# Altium project Pong.PrjPcb (part 2 of 2)

## Sheet VertBallControl.SchDoc: Vertical Ball Control
size A4
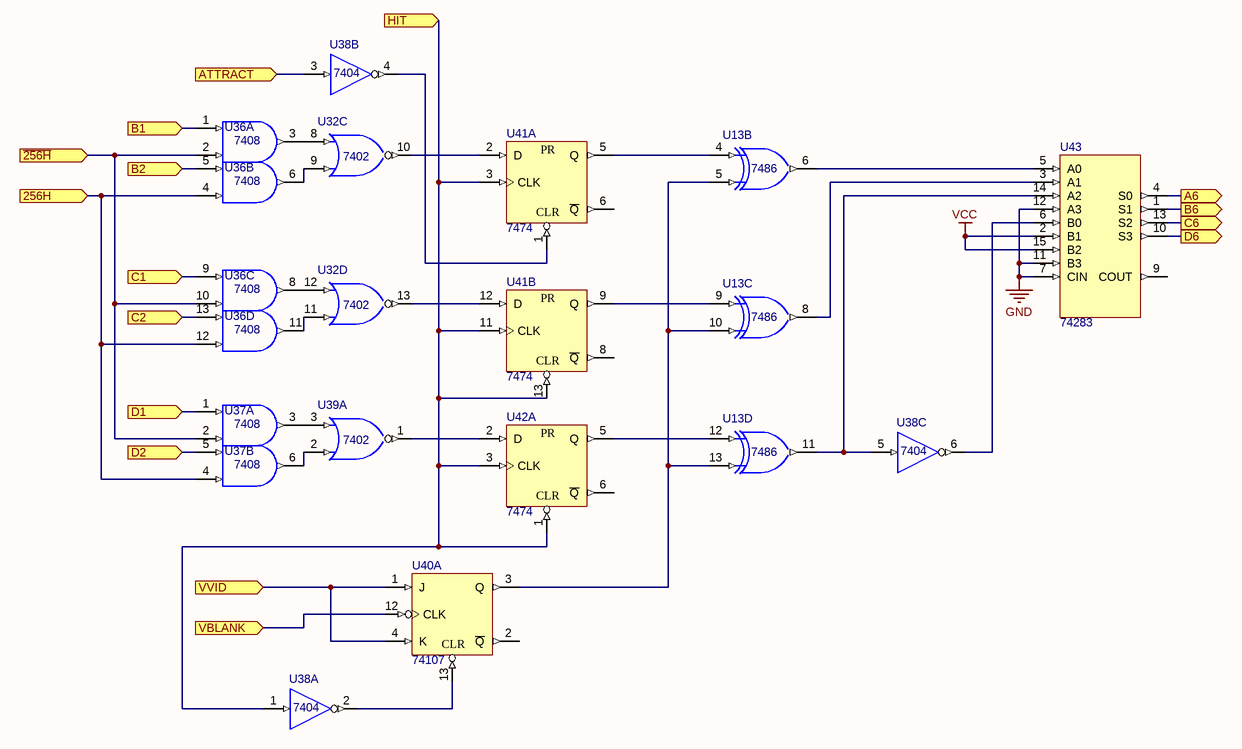
[diagram p11: VertBallControl.SchDoc]

### Parts
U13  7486  [N014]  (parts B,C,D of 4)
U32  7402  [N014]  (parts C,D of 4)
U36  7408  [N014]  (parts A,B,C,D of 4)
U37  7408  [N014]  (parts A,B of 4)
U38  7404  [N014]  (parts A,B,C of 6)
U39  7402  [N014]  (part A of 4)
U40  74107  [N014]  (part A of 2)
U41  7474  [N014D]  (parts A,B of 2)
U42  7474  [N014D]  (part A of 2)
U43  74283  [N016D]

### Ports
256H, A6, ATTRACT, B1, B2, B6, C1, C2, C6, D1, D2, D6, HIT, VBLANK, VVID, ~{256H}

### Nets
GND: U13.7(GND) U32.7(GND) U36.7(GND) U37.7(GND) U38.7(GND) U39.7(GND) U40.7(GND) U41.7(GND) U42.7(GND) U43.7(CIN) U43.8(GND) U43.11(B3) U43.12(A3)
VCC: U13.14(VCC) U32.14(VCC) U36.14(VCC) U37.14(VCC) U38.14(VCC) U39.14(VCC) U40.14(VCC) U41.4(PR) U41.10(PR) U41.14(VCC) U42.4(PR) U42.14(VCC) U43.2(B1) U43.15(B2) U43.16(VCC)
256H: U36.4(A) U36.12(A) U37.4(A) ; port 256H
~{256H}: U36.2(B) U36.10(B) U37.2(B) ; port ~{256H}
A6: U43.4(S0) ; port A6
ATTRACT: U38.3(A) ; port ATTRACT
B1: U36.1(A) ; port B1
B2: U36.5(B) ; port B2
B6: U43.1(S1) ; port B6
C1: U36.9(A) ; port C1
C2: U36.13(B) ; port C2
C6: U43.13(S2) ; port C6
D1: U37.1(A) ; port D1
D2: U37.5(B) ; port D2
D6: U43.10(S3) ; port D6
HIT: U38.1(A) U41.3(CLK) U41.11(CLK) U41.13(CLR) U42.1(CLR) U42.3(CLK) ; port HIT
VBLANK: U40.12(CLK) ; port VBLANK
VVID: U40.1(J) U40.4(K) ; port VVID
NetU13_4: U13.4(A) U41.5(Q)
NetU13_5: U13.5(B) U13.10(B) U13.13(B) U40.3(Q)
NetU13_6: U13.6(Y) U43.5(A0)
NetU13_8: U13.8(Y) U43.3(A1)
NetU13_9: U13.9(A) U41.9(Q)
NetU13_11: U13.11(Y) U38.5(A) U43.14(A2)
NetU13_12: U13.12(A) U42.5(Q)
NetU32_8: U32.8(A) U36.3(Y)
NetU32_9: U32.9(B) U36.6(Y)
NetU32_10: U32.10(Y) U41.2(D)
NetU32_11: U32.11(A) U36.11(Y)
NetU32_12: U32.12(B) U36.8(Y)
NetU32_13: U32.13(Y) U41.12(D)
NetU37_3: U37.3(Y) U39.3(B)
NetU37_6: U37.6(Y) U39.2(A)
NetU38_2: U38.2(Y) U40.13(CLR)
NetU38_4: U38.4(Y) U41.1(CLR)
NetU38_6: U38.6(Y) U43.6(B0)
NetU39_1: U39.1(Y) U42.2(D)

Not connected (* = marked no-connect by the designer): U40 2(~{Q}); U41 6(~{Q}) 8(~{Q}); U42 6(~{Q}); U43 9(COUT)

### Notes on the sheet
- Text
- Page
- PONG

### Library data of the parts
U13 = SN74LS86AN: Quadruple 2-Input Exclusive-OR Gate; Published: 8-Jun-2000; LatestRevisionDate: 04-Mar-2005; LatestRevisionNote: Stylized 3D Model Added.; DatasheetVersion: Mar-1988; PackageVersion: Oct-1995; PackageReference: N014; Publisher: Altium Limited; PackageDescription: DIP; 14 Leads; Row Spacing 7.62 mm; Pitch 2.54 mm; ComponentLink1Description: Manufacturer Link; ComponentLink1URL: http://www.ti.com/; ComponentLink2Description: Datasheet; ComponentLink2URL: http://www-s.ti.com/sc/ds/sn74ls86a.pdf
U32 U39 = SN74LS02N: Quadruple 2-Input Positive-NOR Gate; Published: 8-Jun-2000; LatestRevisionDate: 04-Mar-2005; LatestRevisionNote: Stylized 3D Model Added.; DatasheetVersion: Mar-1988; PackageVersion: Oct-1995; PackageReference: N014; Publisher: Altium Limited; PackageDescription: DIP; 14 Leads; Row Spacing 7.62 mm; Pitch 2.54 mm; ComponentLink1Description: Manufacturer Link; ComponentLink1URL: http://www.ti.com/; ComponentLink2Description: Datasheet; ComponentLink2URL: http://www-s.ti.com/sc/ds/sn54s02.pdf
U36 U37 = SN74LS08N: Quadruple 2-Input Positive-AND Gate; Published: 8-Jun-2000; LatestRevisionDate: 04-Mar-2005; LatestRevisionNote: Stylized 3D Model Added.; DatasheetVersion: Mar-1988; PackageVersion: Oct-1995; PackageReference: N014; Publisher: Altium Limited; PackageDescription: DIP; 14 Leads; Row Spacing 7.62 mm; Pitch 2.54 mm; ComponentLink1Description: Manufacturer Link; ComponentLink1URL: http://www.ti.com/; ComponentLink2Description: Datasheet; ComponentLink2URL: http://www-s.ti.com/sc/ds/SN74LS08.pdf
U38 = SN74LS04N: Hex Inverter; Published: 8-Jun-2000; LatestRevisionDate: 04-Mar-2005; LatestRevisionNote: Stylized 3D Model Added.; DatasheetVersion: Mar-1988; PackageVersion: Oct-1995; PackageReference: N014; Publisher: Altium Limited; PackageDescription: DIP; 14 Leads; Row Spacing 7.62 mm; Pitch 2.54 mm; ComponentLink1Description: Manufacturer Link; ComponentLink1URL: http://www.ti.com/; ComponentLink2Description: Datasheet; ComponentLink2URL: http://www-s.ti.com/sc/ds/sn74ls04.pdf
U40 = SN74LS107AN: Dual J-K Flip-Flop with Clear; Published: 8-Jun-2000; LatestRevisionDate: 04-Mar-2005; LatestRevisionNote: Stylized 3D Model Added.; DatasheetVersion: Mar-1988; PackageVersion: Oct-1995; PackageReference: N014; Publisher: Altium Limited; PackageDescription: DIP; 14 Leads; Row Spacing 7.62 mm; Pitch 2.54 mm; ComponentLink1Description: Manufacturer Link; ComponentLink1URL: http://www.ti.com/; ComponentLink2Description: Datasheet; ComponentLink2URL: http://www-s.ti.com/sc/ds/sn74ls107a.pdf
U41 U42 = SN74LS74AN: Dual D-Type Positive-Edge-Triggered Flip-Flop with Preset and Clear; Published: 8-Jun-2000; LatestRevisionDate: 04-Mar-2005; LatestRevisionNote: Stylized 3D Model Added.; DatasheetVersion: Mar-1988; PackageVersion: Oct-1995; PackageReference: N014D; Publisher: Altium Limited; PackageDescription: DIP; 14 Leads; Row Spacing 7.62 mm; Pitch 2.54 mm; ComponentLink1Description: Manufacturer Link; ComponentLink1URL: http://www.ti.com/; ComponentLink2Description: Datasheet; ComponentLink2URL: http://www-s.ti.com/sc/ds/sn74ls74a.pdf
U43 = SN54S283FK: 4-Bit Binary Full Adder with Fast Carry; Published: 8-Jun-2000; LatestRevisionDate: 04-Mar-2005; LatestRevisionNote: Stylized 3D Model Added.; DatasheetVersion: Mar-1988; PackageVersion: Oct-1995; PackageReference: N016D; Publisher: Altium Limited; PackageDescription: DIP; 16 Leads; Row Spacing 7.62 mm; Pitch 2.54 mm; Code_JEDEC: MS-001-BB; ComponentLink1Description: Manufacturer Link; ComponentLink1URL: http://www.ti.com; ComponentLink2Description: Datasheet; ComponentLink2URL: http://www-s.ti.com/sc/ds/sn54ls283.pdf

## Sheet ScoreCount.SchDoc: Score Count
size A4
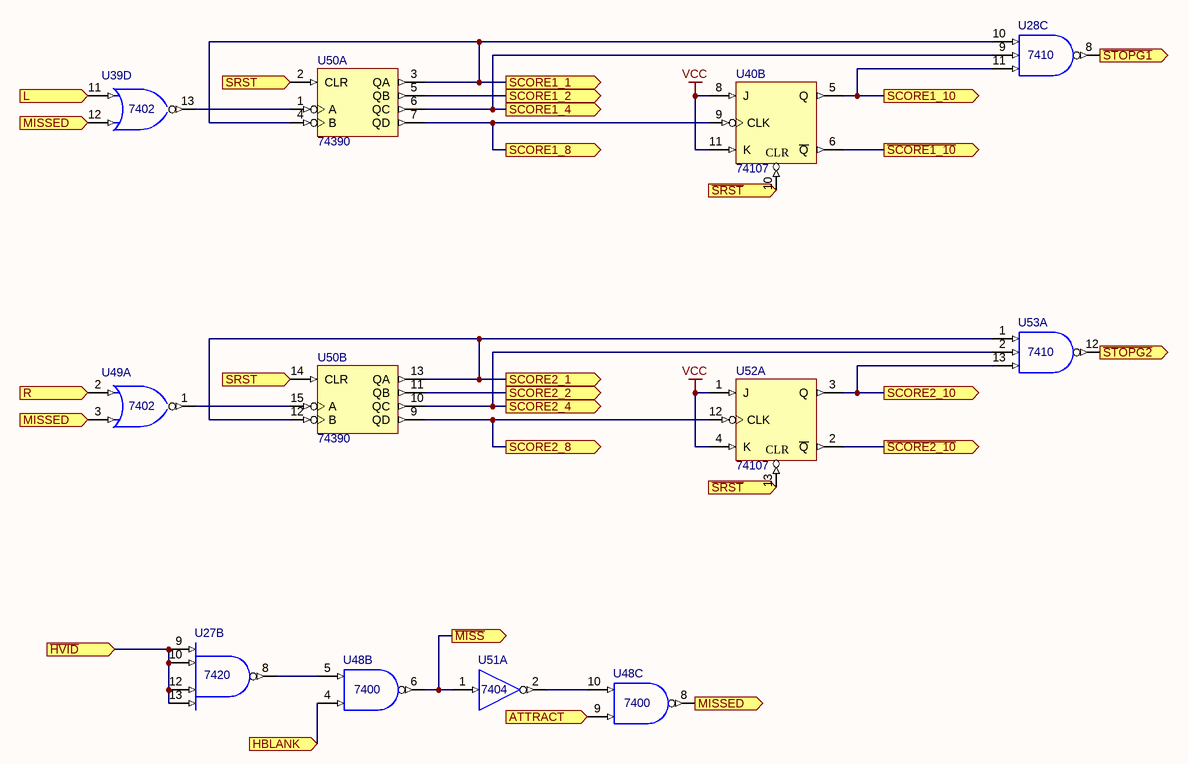
[diagram p12: ScoreCount.SchDoc]

### Parts
U27  7420  [N014]  (part B of 2)
U28  7410  [N014]  (part C of 3)
U39  7402  [N014]  (part D of 4)
U40  74107  [N014]  (part B of 2)
U48  7400  [N014]  (parts B,C of 4)
U49  7402  [N014]  (part A of 4)
U50  74390  [N016]  (parts A,B of 2)
U51  7404  [N014]  (part A of 6)
U52  74107  [N014]  (part A of 2)
U53  7410  [N014]  (part A of 3)

### Ports
ATTRACT, HBLANK, L, MISSED, R, SCORE1_1, SCORE1_2, SCORE1_4, SCORE1_8, SCORE1_10, SCORE2_1, SCORE2_2, SCORE2_4, SCORE2_8, SCORE2_10, SRST, ~{HVID}, ~{MISS}, ~{SCORE1_10}, ~{SCORE2_10}, ~{SRST}, ~{STOPG1}, ~{STOPG2}

### Nets
GND: U27.7(GND) U28.7(GND) U39.7(GND) U40.7(GND) U48.7(GND) U49.7(GND) U50.8(GND) U51.7(GND) U52.7(GND) U53.7(GND)
VCC: U27.14(VCC) U28.14(VCC) U39.14(VCC) U40.8(J) U40.11(K) U40.14(VCC) U48.14(VCC) U49.14(VCC) U50.16(VCC) U51.14(VCC) U52.1(J) U52.4(K) U52.14(VCC) U53.14(VCC)
~{HVID}: U27.9(A) U27.10(B) U27.12(C) U27.13(D) ; port ~{HVID}
~{MISS}: U48.6(Y) U51.1(A) ; port ~{MISS}
~{SCORE1_10}: U40.6(~{Q}) ; port ~{SCORE1_10}
~{SCORE2_10}: U52.2(~{Q}) ; port ~{SCORE2_10}
~{SRST}: U40.10(CLR) U52.13(CLR) ; port ~{SRST}
~{STOPG1}: U28.8(Y) ; port ~{STOPG1}
~{STOPG2}: U53.12(Y) ; port ~{STOPG2}
ATTRACT: U48.9(A) ; port ATTRACT
HBLANK: U48.4(A) ; port HBLANK
L: U39.11(A) ; port L
MISSED: U39.12(B) U48.8(Y) U49.3(B) ; port MISSED
R: U49.2(A) ; port R
SCORE1_1: U28.10(B) U50.3(QA) U50.4(B) ; port SCORE1_1
SCORE1_2: U50.5(QB) ; port SCORE1_2
SCORE1_4: U28.9(A) U50.6(QC) ; port SCORE1_4
SCORE1_8: U40.9(CLK) U50.7(QD) ; port SCORE1_8
SCORE1_10: U28.11(C) U40.5(Q) ; port SCORE1_10
SCORE2_1: U50.12(B) U50.13(QA) U53.1(A) ; port SCORE2_1
SCORE2_2: U50.11(QB) ; port SCORE2_2
SCORE2_4: U50.10(QC) U53.2(B) ; port SCORE2_4
SCORE2_8: U50.9(QD) U52.12(CLK) ; port SCORE2_8
SCORE2_10: U52.3(Q) U53.13(C) ; port SCORE2_10
SRST: U50.2(CLR) U50.14(CLR) ; port SRST
NetU27_8: U27.8(Y) U48.5(B)
NetU39_13: U39.13(Y) U50.1(A)
NetU48_10: U48.10(B) U51.2(Y)
NetU49_1: U49.1(Y) U50.15(A)

### Notes on the sheet
- Text
- Page
- PONG

### Library data of the parts
U27 = SN74LS20N: Dual 4-Input Positive-NAND Gate; Note: Pins 3 and 11 are NC & not drawn.; Published: 8-Jun-2000; LatestRevisionDate: 04-Mar-2005; LatestRevisionNote: Stylized 3D Model Added.; DatasheetVersion: Mar-1988; PackageVersion: Oct-1995; PackageReference: N014; Publisher: Altium Limited; PackageDescription: DIP; 14 Leads; Row Spacing 7.62 mm; Pitch 2.54 mm; ComponentLink1Description: Manufacturer Link; ComponentLink1URL: http://www.ti.com/; ComponentLink2Description: Datasheet; ComponentLink2URL: http://www-s.ti.com/sc/ds/sn74ls20.pdf
U28 U53 = SN74LS10N: Triple 3-Input Positive-NAND Gate; Published: 8-Jun-2000; LatestRevisionDate: 04-Mar-2005; LatestRevisionNote: Stylized 3D Model Added.; DatasheetVersion: Mar-1988; PackageVersion: Oct-1995; PackageReference: N014; Publisher: Altium Limited; PackageDescription: DIP; 14 Leads; Row Spacing 7.62 mm; Pitch 2.54 mm; ComponentLink1Description: Manufacturer Link; ComponentLink1URL: http://www.ti.com/; ComponentLink2Description: Datasheet; ComponentLink2URL: http://www-s.ti.com/sc/ds/sn74ls10.pdf
U39 U49 = SN74LS02N: Quadruple 2-Input Positive-NOR Gate; Published: 8-Jun-2000; LatestRevisionDate: 04-Mar-2005; LatestRevisionNote: Stylized 3D Model Added.; DatasheetVersion: Mar-1988; PackageVersion: Oct-1995; PackageReference: N014; Publisher: Altium Limited; PackageDescription: DIP; 14 Leads; Row Spacing 7.62 mm; Pitch 2.54 mm; ComponentLink1Description: Manufacturer Link; ComponentLink1URL: http://www.ti.com/; ComponentLink2Description: Datasheet; ComponentLink2URL: http://www-s.ti.com/sc/ds/sn54s02.pdf
U40 U52 = SN74LS107AN: Dual J-K Flip-Flop with Clear; Published: 8-Jun-2000; LatestRevisionDate: 04-Mar-2005; LatestRevisionNote: Stylized 3D Model Added.; DatasheetVersion: Mar-1988; PackageVersion: Oct-1995; PackageReference: N014; Publisher: Altium Limited; PackageDescription: DIP; 14 Leads; Row Spacing 7.62 mm; Pitch 2.54 mm; ComponentLink1Description: Manufacturer Link; ComponentLink1URL: http://www.ti.com/; ComponentLink2Description: Datasheet; ComponentLink2URL: http://www-s.ti.com/sc/ds/sn74ls107a.pdf
U48 = SN74LS00N: Quadruple 2-Input Positive-NAND Gate; Published: 8-Jun-2000; LatestRevisionDate: 04-Mar-2005; LatestRevisionNote: Stylized 3D Model Added.; DatasheetVersion: Mar-1988; PackageVersion: Oct-1995; PackageReference: N014; Publisher: Altium Limited; PackageDescription: DIP; 14 Leads; Row Spacing 7.62 mm; Pitch 2.54 mm; ComponentLink1Description: Manufacturer Link; ComponentLink1URL: http://www.ti.com/; ComponentLink2Description: Datasheet; ComponentLink2URL: http://www-s.ti.com/sc/ds/sn74ls00.pdf
U50 = SN74LS390N: Dual 4-Bit Decade and Binary Counter; Published: 8-Jun-2000; LatestRevisionDate: 04-Mar-2005; LatestRevisionNote: Stylized 3D Model Added.; DatasheetVersion: Mar-1988; PackageVersion: Oct-1995; PackageReference: N016; Publisher: Altium Limited; PackageDescription: DIP; 16 Leads; Row Spacing 7.62 mm; Pitch 2.54 mm; Code_JEDEC: MS-001-BB; ComponentLink1Description: Manufacturer Link; ComponentLink1URL: http://www.ti.com/; ComponentLink2Description: Datasheet; ComponentLink2URL: http://www-s.ti.com/sc/ds/sn74393.pdf
U51 = SN74LS04N: Hex Inverter; Published: 8-Jun-2000; LatestRevisionDate: 04-Mar-2005; LatestRevisionNote: Stylized 3D Model Added.; DatasheetVersion: Mar-1988; PackageVersion: Oct-1995; PackageReference: N014; Publisher: Altium Limited; PackageDescription: DIP; 14 Leads; Row Spacing 7.62 mm; Pitch 2.54 mm; ComponentLink1Description: Manufacturer Link; ComponentLink1URL: http://www.ti.com/; ComponentLink2Description: Datasheet; ComponentLink2URL: http://www-s.ti.com/sc/ds/sn74ls04.pdf

## Sheet ScoreDisplay_1.SchDoc: Score Display 1
size A4
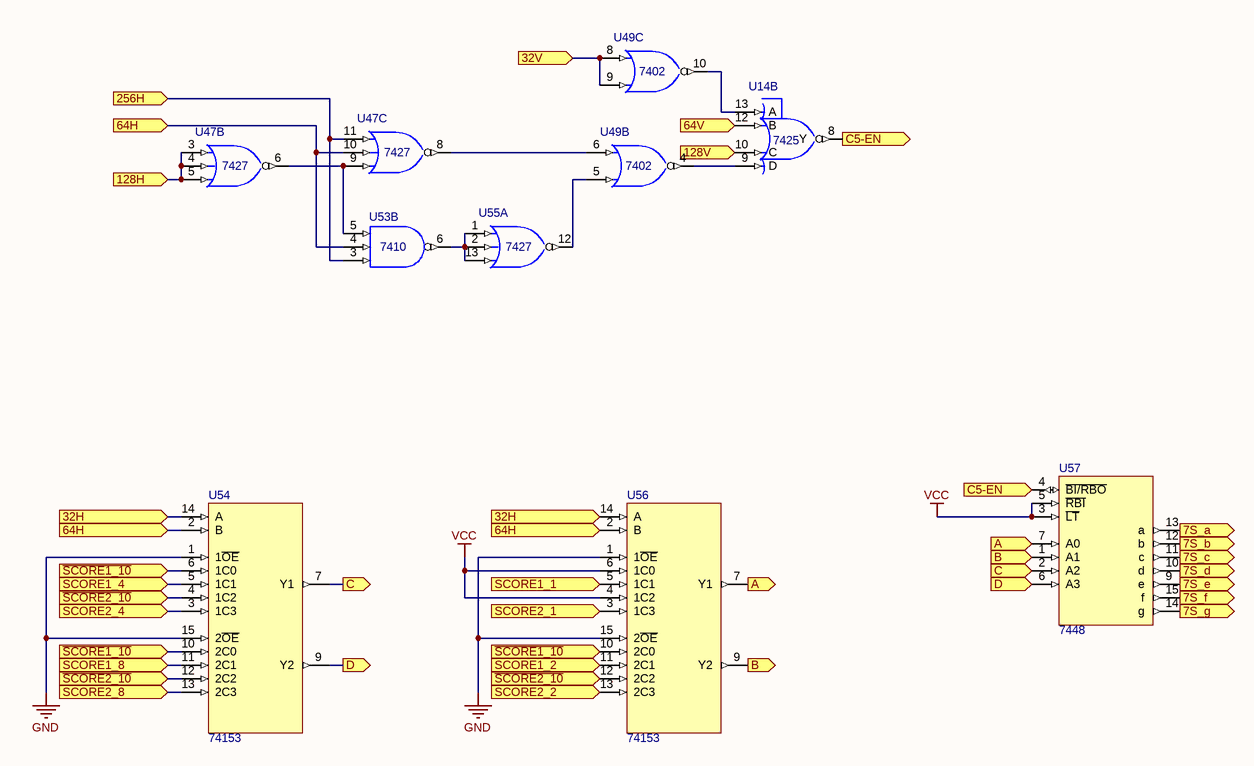
[diagram p13: ScoreDisplay_1.SchDoc]

### Parts
U14  7425  [N014]  (part B of 2)
U47  7427  [N014]  (parts B,C of 3)
U49  7402  [N014]  (parts B,C of 4)
U53  7410  [N014]  (part B of 3)
U54  74153  [N016]
U55  7427  [N014]  (part A of 3)
U56  74153  [N016]
U57  7448  [N016D]

### Ports
7S_a, 7S_b, 7S_c, 7S_d, 7S_e, 7S_f, 7S_g, 32H, 32V, 64H, 64V, 128H, 128V, 256H, A, B, C, C5-EN, D, SCORE1_1, SCORE1_2, SCORE1_4, SCORE1_8, SCORE2_1, SCORE2_2, SCORE2_4, SCORE2_8, ~{SCORE1_10}, ~{SCORE2_10}

### Nets
GND: U14.7(GND) U47.7(GND) U49.7(GND) U53.7(GND) U54.1(1~{OE}) U54.8(GND) U54.15(2~{OE}) U55.7(GND) U56.1(1~{OE}) U56.8(GND) U56.15(2~{OE}) U57.8(GND)
VCC: U14.11(G) U14.14(VCC) U47.14(VCC) U49.14(VCC) U53.14(VCC) U54.16(VCC) U55.14(VCC) U56.4(1C2) U56.6(1C0) U56.16(VCC) U57.3(~{LT}) U57.5(~{RBI}) U57.16(VCC)
7S_a: U57.13(a) ; port 7S_a
7S_b: U57.12(b) ; port 7S_b
7S_c: U57.11(c) ; port 7S_c
7S_d: U57.10(d) ; port 7S_d
7S_e: U57.9(e) ; port 7S_e
7S_f: U57.15(f) ; port 7S_f
7S_g: U57.14(g) ; port 7S_g
32H: U54.14(A) U56.14(A) ; port 32H
32V: U49.8(A) U49.9(B) ; port 32V
64H: U47.10(B) U53.4(B) U54.2(B) U56.2(B) ; port 64H
64V: U14.12(B) ; port 64V
128H: U47.3(A) U47.4(B) U47.5(C) ; port 128H
128V: U14.10(C) ; port 128V
256H: U47.11(C) U53.3(A) ; port 256H
~{SCORE1_10}: U54.6(1C0) U54.10(2C0) U56.10(2C0) ; port ~{SCORE1_10}
~{SCORE2_10}: U54.4(1C2) U54.12(2C2) U56.12(2C2) ; port ~{SCORE2_10}
A: U56.7(Y1) U57.7(A0) ; port A
B: U56.9(Y2) U57.1(A1) ; port B
C: U54.7(Y1) U57.2(A2) ; port C
C5-EN: U14.8(Y) U57.4(~{BI/RBO}) ; port C5-EN
D: U54.9(Y2) U57.6(A3) ; port D
SCORE1_1: U56.5(1C1) ; port SCORE1_1
SCORE1_2: U56.11(2C1) ; port SCORE1_2
SCORE1_4: U54.5(1C1) ; port SCORE1_4
SCORE1_8: U54.11(2C1) ; port SCORE1_8
SCORE2_1: U56.3(1C3) ; port SCORE2_1
SCORE2_2: U56.13(2C3) ; port SCORE2_2
SCORE2_4: U54.3(1C3) ; port SCORE2_4
SCORE2_8: U54.13(2C3) ; port SCORE2_8
NetU14_9: U14.9(D) U49.4(Y)
NetU14_13: U14.13(A) U49.10(Y)
NetU47_6: U47.6(Y) U47.9(A) U53.5(C)
NetU47_8: U47.8(Y) U49.6(B)
NetU49_5: U49.5(A) U55.12(Y)
NetU53_6: U53.6(Y) U55.1(A) U55.2(B) U55.13(C)

### Notes on the sheet
- Text
- Page
- PONG

### Library data of the parts
U14 = SN7425N: Dual 4-Input NOR Gate with Strobe; Published: 8-Jun-2000; LatestRevisionDate: 04-Mar-2005; LatestRevisionNote: Stylized 3D Model Added.; DatasheetVersion: Mar-1988; PackageVersion: Oct-1995; PackageReference: N014; Publisher: Altium Limited; PackageDescription: DIP; 14 Leads; Row Spacing 7.62 mm; Pitch 2.54 mm; ComponentLink1Description: Manufacturer Link; ComponentLink1URL: http://www.ti.com/; ComponentLink2Description: Datasheet; ComponentLink2URL: http://www-s.ti.com/sc/ds/sn5425.pdf; ComponentLink3Description: Packaging Specification; ComponentLink3URL: http://focus.ti.com/lit/ml/mpdi002c/mpdi002c.pdf
U47 U55 = SN74LS27N: Triple 3-Input Positive-NOR Gate; Published: 8-Jun-2000; LatestRevisionDate: 04-Mar-2005; LatestRevisionNote: Stylized 3D Model Added.; DatasheetVersion: Mar-1988; PackageVersion: Oct-1995; PackageReference: N014; Publisher: Altium Limited; PackageDescription: DIP; 14 Leads; Row Spacing 7.62 mm; Pitch 2.54 mm; ComponentLink1Description: Manufacturer Link; ComponentLink1URL: http://www.ti.com/; ComponentLink2Description: Datasheet; ComponentLink2URL: http://www-s.ti.com/sc/ds/sn74ls27.pdf
U49 = SN74LS02N: Quadruple 2-Input Positive-NOR Gate; Published: 8-Jun-2000; LatestRevisionDate: 04-Mar-2005; LatestRevisionNote: Stylized 3D Model Added.; DatasheetVersion: Mar-1988; PackageVersion: Oct-1995; PackageReference: N014; Publisher: Altium Limited; PackageDescription: DIP; 14 Leads; Row Spacing 7.62 mm; Pitch 2.54 mm; ComponentLink1Description: Manufacturer Link; ComponentLink1URL: http://www.ti.com/; ComponentLink2Description: Datasheet; ComponentLink2URL: http://www-s.ti.com/sc/ds/sn54s02.pdf
U53 = SN74LS10N: Triple 3-Input Positive-NAND Gate; Published: 8-Jun-2000; LatestRevisionDate: 04-Mar-2005; LatestRevisionNote: Stylized 3D Model Added.; DatasheetVersion: Mar-1988; PackageVersion: Oct-1995; PackageReference: N014; Publisher: Altium Limited; PackageDescription: DIP; 14 Leads; Row Spacing 7.62 mm; Pitch 2.54 mm; ComponentLink1Description: Manufacturer Link; ComponentLink1URL: http://www.ti.com/; ComponentLink2Description: Datasheet; ComponentLink2URL: http://www-s.ti.com/sc/ds/sn74ls10.pdf
U54 U56 = SN74LS153N: Dual 4-Line to 1-Line Data Selector/Multiplexer; Published: 8-Jun-2000; LatestRevisionDate: 04-Mar-2005; LatestRevisionNote: Stylized 3D Model Added.; DatasheetVersion: Mar-1988; PackageVersion: Oct-1995; PackageReference: N016; Publisher: Altium Limited; PackageDescription: DIP; 16 Leads; Row Spacing 7.62 mm; Pitch 2.54 mm; Code_JEDEC: MS-001-BB; ComponentLink1Description: Manufacturer Link; ComponentLink1URL: http://www.ti.com/; ComponentLink2Description: Datasheet; ComponentLink2URL: http://www-s.ti.com/sc/ds/sn74ls153.pdf
U57 = SN74LS48N: BCD-to-Seven-Segment Decoder/Driver; Published: 8-Jun-2000; LatestRevisionDate: 29-May-2009; LatestRevisionNote: Component Body Added.; DatasheetVersion: Mar-1988; PackageVersion: Oct-1995; PackageReference: N016D; Publisher: Altium Limited; PackageDescription: DIP, 16-Pin, Row Spacing 7.62 mm, Pitch 2.54 mm; Code_JEDEC: MS-001-BB; ComponentLink1Description: Manufacturer Link; ComponentLink1URL: http://www.ti.com/

## Sheet ScoreDisplay_2.SchDoc: Score Display 2
size A4
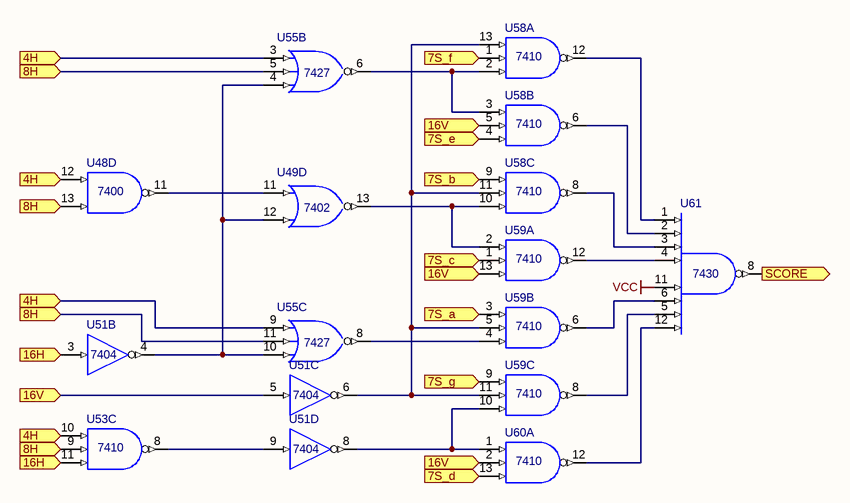
[diagram p14: ScoreDisplay_2.SchDoc]

### Parts
U48  7400  [N014]  (part D of 4)
U49  7402  [N014]  (part D of 4)
U51  7404  [N014]  (parts B,C,D of 6)
U53  7410  [N014]  (part C of 3)
U55  7427  [N014]  (parts B,C of 3)
U58  7410  [N014]  (parts A,B,C of 3)
U59  7410  [N014]  (parts A,B,C of 3)
U60  7410  [N014]  (part A of 3)
U61  7430  [N014]

### Ports
4H, 7S_a, 7S_b, 7S_c, 7S_d, 7S_e, 7S_f, 7S_g, 8H, 16H, 16V, SCORE

### Nets
GND: U48.7(GND) U49.7(GND) U51.7(GND) U53.7(GND) U55.7(GND) U58.7(GND) U59.7(GND) U60.7(GND) U61.7(GND)
VCC: U48.14(VCC) U49.14(VCC) U51.14(VCC) U53.14(VCC) U55.14(VCC) U58.14(VCC) U59.14(VCC) U60.14(VCC) U61.11(G) U61.14(VCC)
4H: U48.12(A) U53.10(B) U55.3(A) U55.9(A) ; port 4H
7S_a: U59.3(A) ; port 7S_a
7S_b: U58.9(A) ; port 7S_b
7S_c: U59.1(A) ; port 7S_c
7S_d: U60.13(C) ; port 7S_d
7S_e: U58.4(B) ; port 7S_e
7S_f: U58.1(A) ; port 7S_f
7S_g: U59.9(A) ; port 7S_g
8H: U48.13(B) U53.9(A) U55.5(C) U55.11(C) ; port 8H
16H: U51.3(A) U53.11(C) ; port 16H
16V: U51.5(A) U58.5(C) U59.13(C) U60.2(B) ; port 16V
SCORE: U61.8(Y) ; port SCORE
NetU48_11: U48.11(Y) U49.11(A)
NetU49_12: U49.12(B) U51.4(Y) U55.4(B) U55.10(B)
NetU49_13: U49.13(Y) U58.10(B) U59.2(B)
NetU51_6: U51.6(Y) U58.11(C) U58.13(C) U59.5(C) U59.11(C)
NetU51_8: U51.8(Y) U59.10(B) U60.1(A)
NetU51_9: U51.9(A) U53.8(Y)
NetU55_6: U55.6(Y) U58.2(B) U58.3(A)
NetU55_8: U55.8(Y) U59.4(B)
NetU58_6: U58.6(Y) U61.2(B)
NetU58_8: U58.8(Y) U61.3(C)
NetU58_12: U58.12(Y) U61.1(A)
NetU59_6: U59.6(Y) U61.6(F)
NetU59_8: U59.8(Y) U61.5(E)
NetU59_12: U59.12(Y) U61.4(D)
NetU60_12: U60.12(Y) U61.12(H)

### Notes on the sheet
- Text
- Page
- PONG

### Library data of the parts
U48 = SN74LS00N: Quadruple 2-Input Positive-NAND Gate; Published: 8-Jun-2000; LatestRevisionDate: 04-Mar-2005; LatestRevisionNote: Stylized 3D Model Added.; DatasheetVersion: Mar-1988; PackageVersion: Oct-1995; PackageReference: N014; Publisher: Altium Limited; PackageDescription: DIP; 14 Leads; Row Spacing 7.62 mm; Pitch 2.54 mm; ComponentLink1Description: Manufacturer Link; ComponentLink1URL: http://www.ti.com/; ComponentLink2Description: Datasheet; ComponentLink2URL: http://www-s.ti.com/sc/ds/sn74ls00.pdf
U49 = SN74LS02N: Quadruple 2-Input Positive-NOR Gate; Published: 8-Jun-2000; LatestRevisionDate: 04-Mar-2005; LatestRevisionNote: Stylized 3D Model Added.; DatasheetVersion: Mar-1988; PackageVersion: Oct-1995; PackageReference: N014; Publisher: Altium Limited; PackageDescription: DIP; 14 Leads; Row Spacing 7.62 mm; Pitch 2.54 mm; ComponentLink1Description: Manufacturer Link; ComponentLink1URL: http://www.ti.com/; ComponentLink2Description: Datasheet; ComponentLink2URL: http://www-s.ti.com/sc/ds/sn54s02.pdf
U51 = SN74LS04N: Hex Inverter; Published: 8-Jun-2000; LatestRevisionDate: 04-Mar-2005; LatestRevisionNote: Stylized 3D Model Added.; DatasheetVersion: Mar-1988; PackageVersion: Oct-1995; PackageReference: N014; Publisher: Altium Limited; PackageDescription: DIP; 14 Leads; Row Spacing 7.62 mm; Pitch 2.54 mm; ComponentLink1Description: Manufacturer Link; ComponentLink1URL: http://www.ti.com/; ComponentLink2Description: Datasheet; ComponentLink2URL: http://www-s.ti.com/sc/ds/sn74ls04.pdf
U53 U58-U60 = SN74LS10N: Triple 3-Input Positive-NAND Gate; Published: 8-Jun-2000; LatestRevisionDate: 04-Mar-2005; LatestRevisionNote: Stylized 3D Model Added.; DatasheetVersion: Mar-1988; PackageVersion: Oct-1995; PackageReference: N014; Publisher: Altium Limited; PackageDescription: DIP; 14 Leads; Row Spacing 7.62 mm; Pitch 2.54 mm; ComponentLink1Description: Manufacturer Link; ComponentLink1URL: http://www.ti.com/; ComponentLink2Description: Datasheet; ComponentLink2URL: http://www-s.ti.com/sc/ds/sn74ls10.pdf
U55 = SN74LS27N: Triple 3-Input Positive-NOR Gate; Published: 8-Jun-2000; LatestRevisionDate: 04-Mar-2005; LatestRevisionNote: Stylized 3D Model Added.; DatasheetVersion: Mar-1988; PackageVersion: Oct-1995; PackageReference: N014; Publisher: Altium Limited; PackageDescription: DIP; 14 Leads; Row Spacing 7.62 mm; Pitch 2.54 mm; ComponentLink1Description: Manufacturer Link; ComponentLink1URL: http://www.ti.com/; ComponentLink2Description: Datasheet; ComponentLink2URL: http://www-s.ti.com/sc/ds/sn74ls27.pdf
U61 = SN74LS30N: 8-Input Positive-NAND Gate; Note: Pins 9, 10  and 13 are NC & not drawn.; Published: 8-Jun-2000; LatestRevisionDate: 04-Mar-2005; LatestRevisionNote: Stylized 3D Model Added.; DatasheetVersion: Mar-1988; PackageVersion: Oct-1995; PackageReference: N014; Publisher: Altium Limited; PackageDescription: DIP; 14 Leads; Row Spacing 7.62 mm; Pitch 2.54 mm; ComponentLink1Description: Manufacturer Link; ComponentLink1URL: http://www.ti.com/; ComponentLink2Description: Datasheet; ComponentLink2URL: http://www-s.ti.com/sc/ds/sn74s30.pdf

## Sheet GameControl.SchDoc: Game Control
size A4
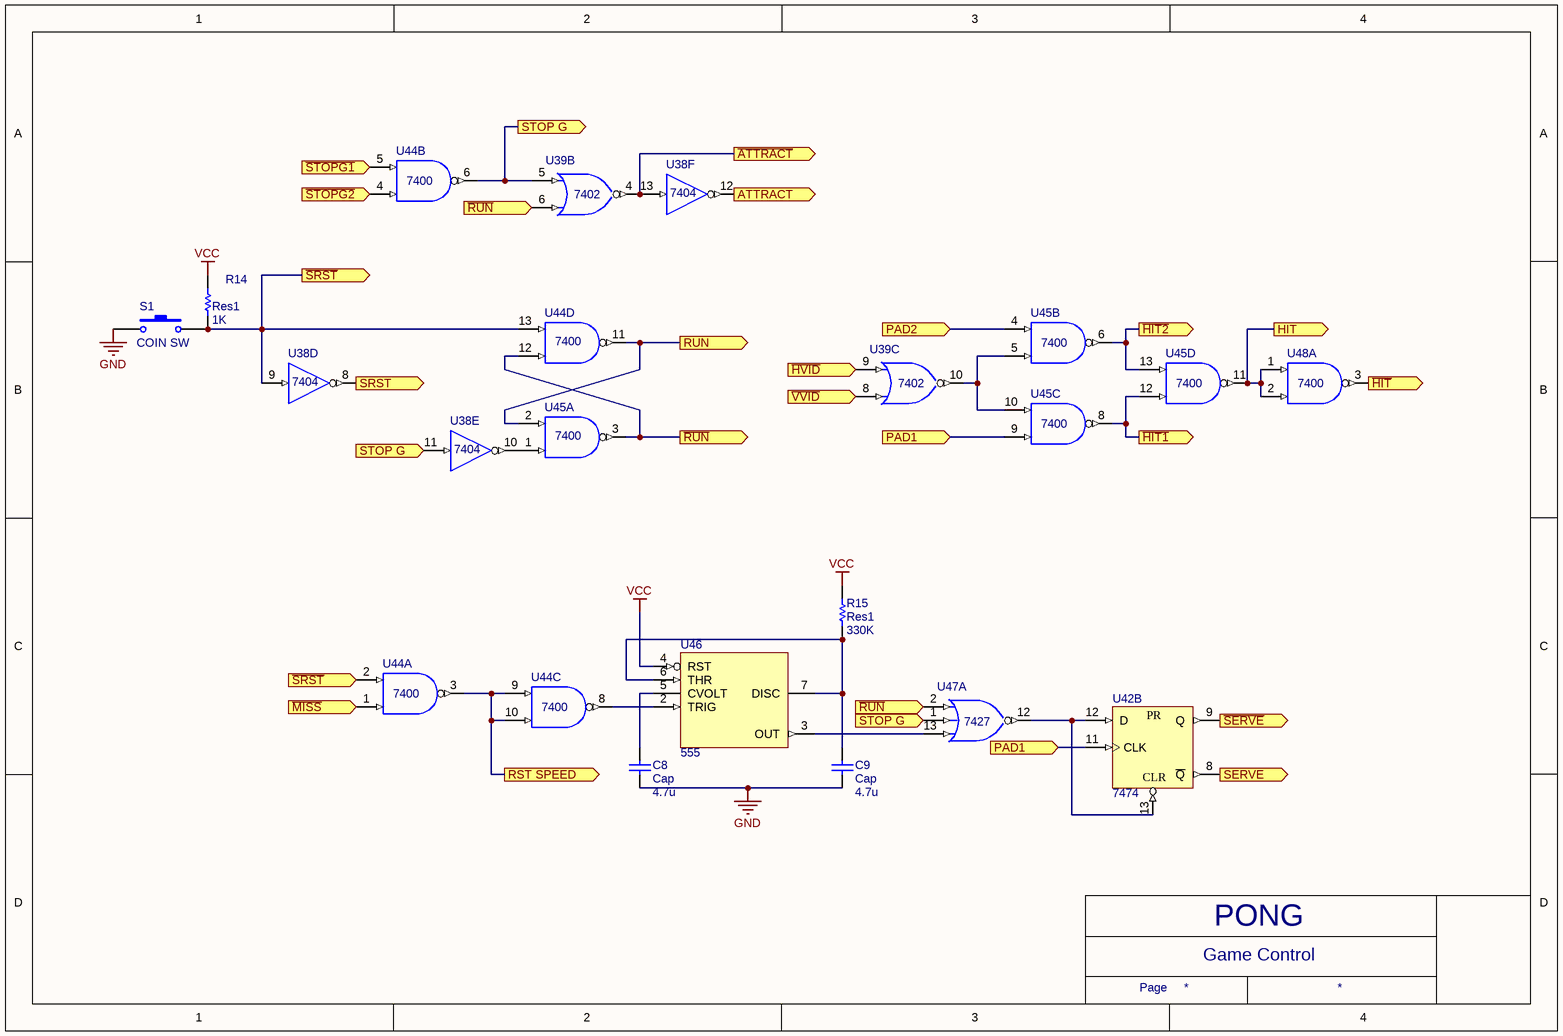
[diagram p15: GameControl.SchDoc]

### Parts
C8  Cap  value 4.7u  [CAPR10.16-11.5x3.6]
C9  Cap  value 4.7u  [CAPR10.16-11.5x3.6]
R14  Res1  value 1K  [AXIAL-0.4]
R15  Res1  value 330K  [AXIAL-0.4]
S1  COIN SW  [SPST-2]
U38  7404  [N014]  (parts D,E,F of 6)
U39  7402  [N014]  (parts B,C of 4)
U42  7474  [N014D]  (part B of 2)
U44  7400  [N014]  (parts A,B,C,D of 4)
U45  7400  [N014]  (parts A,B,C,D of 4)
U46  555  [P008]
U47  7427  [N014]  (part A of 3)
U48  7400  [N014]  (part A of 4)

### Ports
ATTRACT, HIT, PAD1, PAD2, RST SPEED, RUN, SERVE, SRST, STOP G, ~{ATTRACT}, ~{HIT1}, ~{HIT2}, ~{HIT}, ~{HVID}, ~{MISS}, ~{RUN}, ~{SERVE}, ~{SRST}, ~{STOPG1}, ~{STOPG2}, ~{VVID}

### Nets
GND: C8.1 C9.1 S1.1 U38.7(GND) U39.7(GND) U42.7(GND) U44.7(GND) U45.7(GND) U46.1(GND) U47.7(GND) U48.7(GND)
VCC: R14.2 R15.2 U38.14(VCC) U39.14(VCC) U42.10(PR) U42.14(VCC) U44.14(VCC) U45.14(VCC) U46.4(RST) U46.8(VCC) U47.14(VCC) U48.14(VCC)
~{ATTRACT}: U38.13(A) U39.4(Y) ; port ~{ATTRACT}
~{HIT}: U48.3(Y) ; port ~{HIT}
~{HIT1}: U45.8(Y) U45.12(A) ; port ~{HIT1}
~{HIT2}: U45.6(Y) U45.13(B) ; port ~{HIT2}
~{HVID}: U39.9(B) ; port ~{HVID}
~{MISS}: U44.1(A) ; port ~{MISS}
~{RUN}: U39.6(B) U44.12(A) U45.3(Y) U47.2(B) ; port ~{RUN}
~{SERVE}: U42.9(Q) ; port ~{SERVE}
~{SRST}: R14.1 S1.2 U38.9(A) U44.2(B) U44.13(B) ; port ~{SRST}
~{STOPG1}: U44.5(B) ; port ~{STOPG1}
~{STOPG2}: U44.4(A) ; port ~{STOPG2}
~{VVID}: U39.8(A) ; port ~{VVID}
ATTRACT: U38.12(Y) ; port ATTRACT
HIT: U45.11(Y) U48.1(A) U48.2(B) ; port HIT
PAD1: U42.11(CLK) U45.9(A) ; port PAD1
PAD2: U45.4(A) ; port PAD2
RST SPEED: U44.3(Y) U44.9(A) U44.10(B) ; port RST SPEED
RUN: U44.11(Y) U45.2(B) ; port RUN
SERVE: U42.8(~{Q}) ; port SERVE
SRST: U38.8(Y) ; port SRST
STOP G: U38.11(A) U39.5(A) U44.6(Y) U47.1(A) ; port STOP G
NetC8_2: C8.2 U46.5(CVOLT)
NetC9_2: C9.2 R15.1 U46.6(THR) U46.7(DISC)
NetU38_10: U38.10(Y) U45.1(A)
NetU39_10: U39.10(Y) U45.5(B) U45.10(B)
NetU42_12: U42.12(D) U42.13(CLR) U47.12(Y)
NetU44_8: U44.8(Y) U46.2(TRIG)
NetU46_3: U46.3(OUT) U47.13(C)

### Notes on the sheet
- Text
- Page
- PONG

### Library data of the parts
C8 C9 = Cap: Capacitor; Published: 8-Jun-2000; LatestRevisionDate: 17-Jul-2002; LatestRevisionNote: Re-released for DXP Platform.; PackageReference: RAD-0.3; Publisher: Altium Limited; PackageDescription: Radial Cap, Thru-Hole; 2 Leads; 0.3 in Pin Spacing
R14 R15 = Res1: Resistor; Published: 8-Jun-2000; LatestRevisionDate: 17-Jul-2002; LatestRevisionNote: Re-released for DXP Platform.; PackageReference: AXIAL-0.3; Publisher: Altium Limited; PackageDescription: Axial Device, Thru-Hole; 2 Leads; 0.3 in Pin Spacing
S1 = SW-PB: Switch; Published: 24-Mar-1999; LatestRevisionDate: 17-Jul-2002; LatestRevisionNote: Re-released for DXP Platform.; PackageReference: SPST-2; Publisher: Altium Limited; PackageDescription: Switch; 2 Leads
U38 = SN74LS04N: Hex Inverter; Published: 8-Jun-2000; LatestRevisionDate: 04-Mar-2005; LatestRevisionNote: Stylized 3D Model Added.; DatasheetVersion: Mar-1988; PackageVersion: Oct-1995; PackageReference: N014; Publisher: Altium Limited; PackageDescription: DIP; 14 Leads; Row Spacing 7.62 mm; Pitch 2.54 mm; ComponentLink1Description: Manufacturer Link; ComponentLink1URL: http://www.ti.com/; ComponentLink2Description: Datasheet; ComponentLink2URL: http://www-s.ti.com/sc/ds/sn74ls04.pdf
U39 = SN74LS02N: Quadruple 2-Input Positive-NOR Gate; Published: 8-Jun-2000; LatestRevisionDate: 04-Mar-2005; LatestRevisionNote: Stylized 3D Model Added.; DatasheetVersion: Mar-1988; PackageVersion: Oct-1995; PackageReference: N014; Publisher: Altium Limited; PackageDescription: DIP; 14 Leads; Row Spacing 7.62 mm; Pitch 2.54 mm; ComponentLink1Description: Manufacturer Link; ComponentLink1URL: http://www.ti.com/; ComponentLink2Description: Datasheet; ComponentLink2URL: http://www-s.ti.com/sc/ds/sn54s02.pdf
U42 = SN74LS74AN: as U41 on sheet VertBallControl; Published: 8-Jun-2000; LatestRevisionDate: 04-Mar-2005; LatestRevisionNote: Stylized 3D Model Added.; DatasheetVersion: Mar-1988; PackageVersion: Oct-1995; PackageReference: N014D; Publisher: Altium Limited; PackageDescription: DIP; 14 Leads; Row Spacing 7.62 mm; Pitch 2.54 mm; ComponentLink1Description: Manufacturer Link; ComponentLink1URL: http://www.ti.com/; ComponentLink2Description: Datasheet; ComponentLink2URL: http://www-s.ti.com/sc/ds/sn74ls74a.pdf
U44 U45 U48 = SN74LS00N: Quadruple 2-Input Positive-NAND Gate; Published: 8-Jun-2000; LatestRevisionDate: 04-Mar-2005; LatestRevisionNote: Stylized 3D Model Added.; DatasheetVersion: Mar-1988; PackageVersion: Oct-1995; PackageReference: N014; Publisher: Altium Limited; PackageDescription: DIP; 14 Leads; Row Spacing 7.62 mm; Pitch 2.54 mm; ComponentLink1Description: Manufacturer Link; ComponentLink1URL: http://www.ti.com/; ComponentLink2Description: Datasheet; ComponentLink2URL: http://www-s.ti.com/sc/ds/sn74ls00.pdf
U46 = NE555P: Precision Timer; Published: 16-Jan-2001; LatestRevisionDate: 04-Mar-2005; LatestRevisionNote: Stylized 3D Model Added.; DatasheetVersion: Feb-1992; PackageVersion: Jun-1999; PackageReference: P008; Publisher: Altium Limited; PackageDescription: DIP; 8 Leads; Row Spacing 7.62 mm; Pitch 2.54 mm; Code_JEDEC: MO-001-AN; ComponentLink1Description: Manufacturer Link; ComponentLink1URL: http://www.ti.com/; ComponentLink2Description: Datasheet; ComponentLink2URL: http://www-s.ti.com/sc/ds/ne555.pdf
U47 = SN74LS27N: Triple 3-Input Positive-NOR Gate; Published: 8-Jun-2000; LatestRevisionDate: 04-Mar-2005; LatestRevisionNote: Stylized 3D Model Added.; DatasheetVersion: Mar-1988; PackageVersion: Oct-1995; PackageReference: N014; Publisher: Altium Limited; PackageDescription: DIP; 14 Leads; Row Spacing 7.62 mm; Pitch 2.54 mm; ComponentLink1Description: Manufacturer Link; ComponentLink1URL: http://www.ti.com/; ComponentLink2Description: Datasheet; ComponentLink2URL: http://www-s.ti.com/sc/ds/sn74ls27.pdf

## Sheet Sound.SchDoc: Sound
size A4
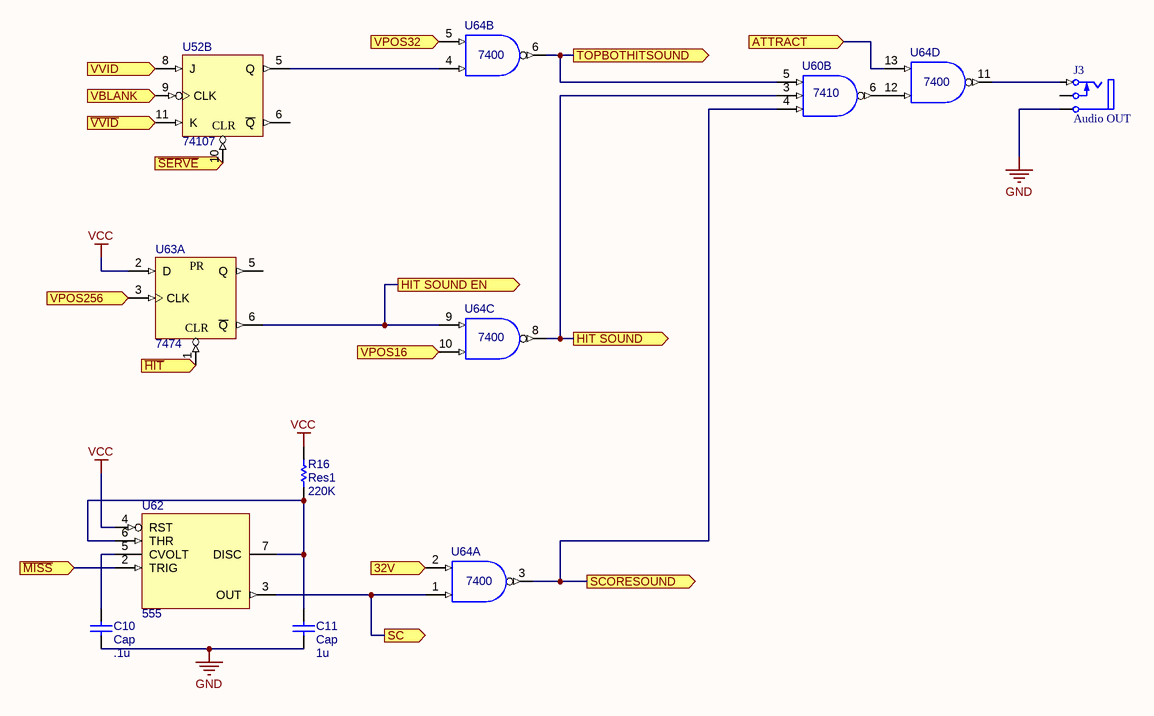
[diagram p16: Sound.SchDoc]

### Parts
C10  Cap  value .1u  [CAPR10.16-11.5x3.6]
C11  Cap  value 1u  [CAPR10.16-11.5x3.6]
J3  Audio OUT  [RCA 2]
R16  Res1  value 220K  [AXIAL-0.4]
U52  74107  [N014]  (part B of 2)
U60  7410  [N014]  (part B of 3)
U62  555  [P008]
U63  7474  [N014D]  (part A of 2)
U64  7400  [N014]  (parts A,B,C,D of 4)

### Ports
32V, ATTRACT, HIT SOUND, HIT SOUND EN, SC, SCORESOUND, TOPBOTHITSOUND, VBLANK, VPOS16, VPOS32, VPOS256, VVID, ~{HIT}, ~{MISS}, ~{SERVE}, ~{VVID}

### Nets
GND: C10.1 C11.1 J3.1(S) U52.7(GND) U60.7(GND) U62.1(GND) U63.7(GND) U64.7(GND)
VCC: R16.2 U52.14(VCC) U60.14(VCC) U62.4(RST) U62.8(VCC) U63.2(D) U63.4(PR) U63.14(VCC) U64.14(VCC)
32V: U64.2(B) ; port 32V
~{HIT}: U63.1(CLR) ; port ~{HIT}
~{MISS}: U62.2(TRIG) ; port ~{MISS}
~{SERVE}: U52.10(CLR) ; port ~{SERVE}
~{VVID}: U52.11(K) ; port ~{VVID}
ATTRACT: U64.13(B) ; port ATTRACT
HIT SOUND: U60.3(A) U64.8(Y) ; port HIT SOUND
HIT SOUND EN: U63.6(~{Q}) U64.9(A) ; port HIT SOUND EN
SC: U62.3(OUT) U64.1(A) ; port SC
SCORESOUND: U60.4(B) U64.3(Y) ; port SCORESOUND
TOPBOTHITSOUND: U60.5(C) U64.6(Y) ; port TOPBOTHITSOUND
VBLANK: U52.9(CLK) ; port VBLANK
VPOS16: U64.10(B) ; port VPOS16
VPOS32: U64.5(B) ; port VPOS32
VPOS256: U63.3(CLK) ; port VPOS256
VVID: U52.8(J) ; port VVID
NetC10_2: C10.2 U62.5(CVOLT)
NetC11_2: C11.2 R16.1 U62.6(THR) U62.7(DISC)
NetJ3_2: J3.2(T) U64.11(Y)
NetU52_5: U52.5(Q) U64.4(A)
NetU60_6: U60.6(Y) U64.12(A)

Not connected (* = marked no-connect by the designer): J3 3(TN); U52 6(~{Q}); U63 5(Q)

### Notes on the sheet
- Text
- Page
- PONG

### Library data of the parts
C10 C11 = Cap: Capacitor; Published: 8-Jun-2000; LatestRevisionDate: 17-Jul-2002; LatestRevisionNote: Re-released for DXP Platform.; PackageReference: RAD-0.3; Publisher: Altium Limited; PackageDescription: Radial Cap, Thru-Hole; 2 Leads; 0.3 in Pin Spacing
J3 = Phonejack2 TN: Jack Socket, 1/4" [6.5mm], Thru-Hole, Vertical, 2-Conductor with Tip closed; PackageDocument: 2003; PCB_Layout: Complies with manufacturer's recommendation.; DrillAndSlotSize: Corresponds to nominal value.; LatestRevisionDate: 15-Jul-2004; LatestRevisionNote: Component Replaced & renamed from "Phonejack".; DatasheetDocument: 2003; PackageReference: S1VS_SNB; Publisher: Altium Limited; ComponentLink1Description: Manufacturer Link; ComponentLink1URL: http://www.cliffuk.co.uk/
R16 = Res1: Resistor; Published: 8-Jun-2000; LatestRevisionDate: 17-Jul-2002; LatestRevisionNote: Re-released for DXP Platform.; PackageReference: AXIAL-0.3; Publisher: Altium Limited; PackageDescription: Axial Device, Thru-Hole; 2 Leads; 0.3 in Pin Spacing
U52 = SN74LS107AN: Dual J-K Flip-Flop with Clear; Published: 8-Jun-2000; LatestRevisionDate: 04-Mar-2005; LatestRevisionNote: Stylized 3D Model Added.; DatasheetVersion: Mar-1988; PackageVersion: Oct-1995; PackageReference: N014; Publisher: Altium Limited; PackageDescription: DIP; 14 Leads; Row Spacing 7.62 mm; Pitch 2.54 mm; ComponentLink1Description: Manufacturer Link; ComponentLink1URL: http://www.ti.com/; ComponentLink2Description: Datasheet; ComponentLink2URL: http://www-s.ti.com/sc/ds/sn74ls107a.pdf
U60 = SN74LS10N: Triple 3-Input Positive-NAND Gate; Published: 8-Jun-2000; LatestRevisionDate: 04-Mar-2005; LatestRevisionNote: Stylized 3D Model Added.; DatasheetVersion: Mar-1988; PackageVersion: Oct-1995; PackageReference: N014; Publisher: Altium Limited; PackageDescription: DIP; 14 Leads; Row Spacing 7.62 mm; Pitch 2.54 mm; ComponentLink1Description: Manufacturer Link; ComponentLink1URL: http://www.ti.com/; ComponentLink2Description: Datasheet; ComponentLink2URL: http://www-s.ti.com/sc/ds/sn74ls10.pdf
U62 = NE555P: Precision Timer; Published: 16-Jan-2001; LatestRevisionDate: 04-Mar-2005; LatestRevisionNote: Stylized 3D Model Added.; DatasheetVersion: Feb-1992; PackageVersion: Jun-1999; PackageReference: P008; Publisher: Altium Limited; PackageDescription: DIP; 8 Leads; Row Spacing 7.62 mm; Pitch 2.54 mm; Code_JEDEC: MO-001-AN; ComponentLink1Description: Manufacturer Link; ComponentLink1URL: http://www.ti.com/; ComponentLink2Description: Datasheet; ComponentLink2URL: http://www-s.ti.com/sc/ds/ne555.pdf
U63 = SN74LS74AN: as U41 on sheet VertBallControl; Published: 8-Jun-2000; LatestRevisionDate: 04-Mar-2005; LatestRevisionNote: Stylized 3D Model Added.; DatasheetVersion: Mar-1988; PackageVersion: Oct-1995; PackageReference: N014D; Publisher: Altium Limited; PackageDescription: DIP; 14 Leads; Row Spacing 7.62 mm; Pitch 2.54 mm; ComponentLink1Description: Manufacturer Link; ComponentLink1URL: http://www.ti.com/; ComponentLink2Description: Datasheet; ComponentLink2URL: http://www-s.ti.com/sc/ds/sn74ls74a.pdf
U64 = SN74LS00N: Quadruple 2-Input Positive-NAND Gate; Published: 8-Jun-2000; LatestRevisionDate: 04-Mar-2005; LatestRevisionNote: Stylized 3D Model Added.; DatasheetVersion: Mar-1988; PackageVersion: Oct-1995; PackageReference: N014; Publisher: Altium Limited; PackageDescription: DIP; 14 Leads; Row Spacing 7.62 mm; Pitch 2.54 mm; ComponentLink1Description: Manufacturer Link; ComponentLink1URL: http://www.ti.com/; ComponentLink2Description: Datasheet; ComponentLink2URL: http://www-s.ti.com/sc/ds/sn74ls00.pdf

## Nets that join several sheets
GND: POWER (11 pins), CLK (C1.1 C2.1 U1.7 U2.7), HSYNC (7 pins), VSYNC (7 pins), SYNC-VideoSum (5 pins), Paddle_1 (8 pins), Paddle_2 (10 pins), Net (U15.7 U16.7 U17.7), HorizBallCounter (10 pins), HorizBallControl (9 pins), VertBallCounter (9 pins), VertBallControl (13 pins), ScoreCount (10 pins), ScoreDisplay_1 (12 pins), ScoreDisplay_2 (9 pins), GameControl (11 pins), Sound (8 pins)
VCC: POWER (11 pins), CLK (5 pins), HSYNC (27 pins), VSYNC (24 pins), SYNC-VideoSum (5 pins), Paddle_1 (14 pins), Paddle_2 (17 pins), Net (U15.13 U15.14 U16.14 U17.14), HorizBallCounter (12 pins), HorizBallControl (15 pins), VertBallCounter (9 pins), VertBallControl (15 pins), ScoreCount (14 pins), ScoreDisplay_1 (13 pins), ScoreDisplay_2 (10 pins), GameControl (12 pins), Sound (9 pins)
1H: HSYNC (U3.14), Net (U15.12)
4H: HSYNC (U3.12 U6.5), Paddle_2 (U21.3), ScoreDisplay_2 (U48.12 U53.10 U55.3 U55.9)
4V: VSYNC (U8.5 U8.11 U10.12), Net (U17.13)
7S_a: ScoreDisplay_1 (U57.13), ScoreDisplay_2 (U59.3)
7S_b: ScoreDisplay_1 (U57.12), ScoreDisplay_2 (U58.9)
7S_c: ScoreDisplay_1 (U57.11), ScoreDisplay_2 (U59.1)
7S_d: ScoreDisplay_1 (U57.10), ScoreDisplay_2 (U60.13)
7S_e: ScoreDisplay_1 (U57.9), ScoreDisplay_2 (U58.4)
7S_f: ScoreDisplay_1 (U57.15), ScoreDisplay_2 (U58.1)
7S_g: ScoreDisplay_1 (U57.14), ScoreDisplay_2 (U59.9)
8H: HSYNC (U3.11), ScoreDisplay_2 (U48.13 U53.9 U55.5 U55.11)
16H: HSYNC (U4.14 U8.2 U9.10), ScoreDisplay_2 (U51.3 U53.11)
16V: VSYNC (U11.14 U12.6), ScoreDisplay_2 (U51.5 U58.5 U59.13 U60.2)
32H: HSYNC (U4.13), ScoreDisplay_1 (U54.14 U56.14)
32V: VSYNC (U11.13), ScoreDisplay_1 (U49.8 U49.9), Sound (U64.2)
64H: HSYNC (U4.12 U6.6 U8.1 U8.13), ScoreDisplay_1 (U47.10 U53.4 U54.2 U56.2)
64V: VSYNC (U11.12), ScoreDisplay_1 (U14.12)
128H: HSYNC (U4.11 U6.11), Paddle_2 (U16.10 U21.2), ScoreDisplay_1 (U47.3 U47.4 U47.5)
128V: VSYNC (U11.11), ScoreDisplay_1 (U14.10)
256H: HSYNC (U5.3 U6.2), Paddle_2 (U17.4), Net (U15.1 U16.1), VertBallControl (U36.4 U36.12 U37.4), ScoreDisplay_1 (U47.11 U53.3)
~{256H}: HSYNC (U5.2), Paddle_2 (U17.11), Net (U15.4), HorizBallControl (U32.6), VertBallControl (U36.2 U36.10 U37.2)
~{256V}: VSYNC (U5.6), Paddle_1 (U18.2), Paddle_2 (U22.2)
~{ATTRACT}: Paddle_2 (U21.4), HorizBallCounter (U26.2), GameControl (U38.13 U39.4)
~{HBLANK}: HSYNC (U9.3 U9.4), HorizBallCounter (U24.10)
~{HIT}: GameControl (U48.3), Sound (U63.1)
~{HIT1}: HorizBallControl (U21.13), GameControl (U45.8 U45.12)
~{HIT2}: HorizBallControl (U21.10), GameControl (U45.6 U45.13)
~{HSYNC}: HSYNC (U9.8), SYNC-VideoSum (U13.1), Paddle_1 (U19.2), Paddle_2 (U23.2), VertBallCounter (U29.2 U30.2)
~{HVID}: SYNC-VideoSum (U12.8), HorizBallCounter (U27.6), ScoreCount (U27.9 U27.10 U27.12 U27.13), GameControl (U39.9)
~{MISS}: ScoreCount (U48.6 U51.1), GameControl (U44.1), Sound (U62.2)
~{SCORE1_10}: ScoreCount (U40.6), ScoreDisplay_1 (U54.6 U54.10 U56.10)
~{SCORE2_10}: ScoreCount (U52.2), ScoreDisplay_1 (U54.4 U54.12 U56.12)
~{SERVE}: GameControl (U42.9), Sound (U52.10)
~{SRST}: ScoreCount (U40.10 U52.13), GameControl (5 pins)
~{STOPG1}: ScoreCount (U28.8), GameControl (U44.5)
~{STOPG2}: ScoreCount (U53.12), GameControl (U44.4)
~{VBLANK}: VSYNC (U12.1 U12.5), VertBallCounter (U29.10)
~{VPAD1}: Paddle_1 (U16.6), Paddle_2 (U17.3)
~{VSYNC}: VSYNC (U8.8), SYNC-VideoSum (U13.2)
~{VVID}: SYNC-VideoSum (U12.9), VertBallCounter (U12.11 U12.12 U28.6), GameControl (U39.8), Sound (U52.11)
A6: VertBallCounter (U29.3), VertBallControl (U43.4)
Aa: HorizBallCounter (U24.3), HorizBallControl (U34.8)
ATTRACT: HorizBallControl (U26.10), VertBallControl (U38.3), ScoreCount (U48.9), GameControl (U38.12), Sound (U64.13)
B1: Paddle_1 (U19.13 U20.2), VertBallControl (U36.1)
B2: Paddle_2 (U20.9 U23.13), VertBallControl (U36.5)
B6: VertBallCounter (U29.4), VertBallControl (U43.1)
Bb: HorizBallCounter (U24.4), HorizBallControl (U34.6 U34.9)
C1: Paddle_1 (U19.12 U20.1), VertBallControl (U36.9)
C2: Paddle_2 (U20.12 U23.12), VertBallControl (U36.13)
C6: VertBallCounter (U29.5), VertBallControl (U43.13)
CLK: CLK (U2.3), HSYNC (U3.2 U4.2 U7.3), VSYNC (U7.11), HorizBallCounter (U24.2 U25.2)
D1: Paddle_1 (U19.11 U20.4), VertBallControl (U37.1)
D2: Paddle_2 (U20.13 U23.11), VertBallControl (U37.5)
D6: VertBallCounter (U29.6), VertBallControl (U43.10)
HBLANK: HSYNC (U9.2 U9.6 U9.9), ScoreCount (U48.4)
HIT: VertBallControl (6 pins), GameControl (U45.11 U48.1 U48.2)
HIT SOUND: HorizBallControl (U31.2), Sound (U60.3 U64.8)
HRESET: HSYNC (U7.6), VSYNC (U10.2 U11.2)
L: HorizBallControl (U21.9 U34.1), ScoreCount (U39.11)
NET: SYNC-VideoSum (U14.2), Net (U17.12)
PAD1: SYNC-VideoSum (U14.4), Paddle_2 (U17.6), GameControl (U42.11 U45.9)
PAD2: SYNC-VideoSum (U14.5), Paddle_2 (U17.8), GameControl (U45.4)
R: HorizBallControl (U21.8 U21.12 U34.5), ScoreCount (U49.2)
RST SPEED: HorizBallControl (U31.1), GameControl (U44.3 U44.9 U44.10)
SC: HorizBallControl (U26.9), Sound (U62.3 U64.1)
SCORE: SYNC-VideoSum (R5.1), ScoreDisplay_2 (U61.8)
SCORE1_1: ScoreCount (U28.10 U50.3 U50.4), ScoreDisplay_1 (U56.5)
SCORE1_2: ScoreCount (U50.5), ScoreDisplay_1 (U56.11)
SCORE1_4: ScoreCount (U28.9 U50.6), ScoreDisplay_1 (U54.5)
SCORE1_8: ScoreCount (U40.9 U50.7), ScoreDisplay_1 (U54.11)
SCORE2_1: ScoreCount (U50.12 U50.13 U53.1), ScoreDisplay_1 (U56.3)
SCORE2_2: ScoreCount (U50.11), ScoreDisplay_1 (U56.13)
SCORE2_4: ScoreCount (U50.10 U53.2), ScoreDisplay_1 (U54.3)
SCORE2_8: ScoreCount (U50.9 U52.12), ScoreDisplay_1 (U54.13)
SERVE: HorizBallCounter (U26.1), GameControl (U42.8)
SRST: ScoreCount (U50.2 U50.14), GameControl (U38.8)
VBLANK: VSYNC (U8.9 U12.3 U12.4), Net (U17.1), VertBallControl (U40.12), Sound (U52.9)
VPOS16: VertBallCounter (U30.14), Sound (U64.10)
VPOS32: VertBallCounter (U30.13), Sound (U64.5)
VPOS256: VertBallCounter (U26.5 U28.3 U30.15), Sound (U63.3)
VRESET: VSYNC (U7.8 U12.2), HorizBallControl (U32.5 U33.5 U33.12)
VVID: VertBallCounter (U12.13), VertBallControl (U40.1 U40.4), Sound (U52.8)